# Altium schematic sheet AmplifierDclass_Driver.SchDoc
size 420 x 297 mm; DocumentNumber: Введите номер платы + Э3; SheetNumber: номер страницы; Format: A3
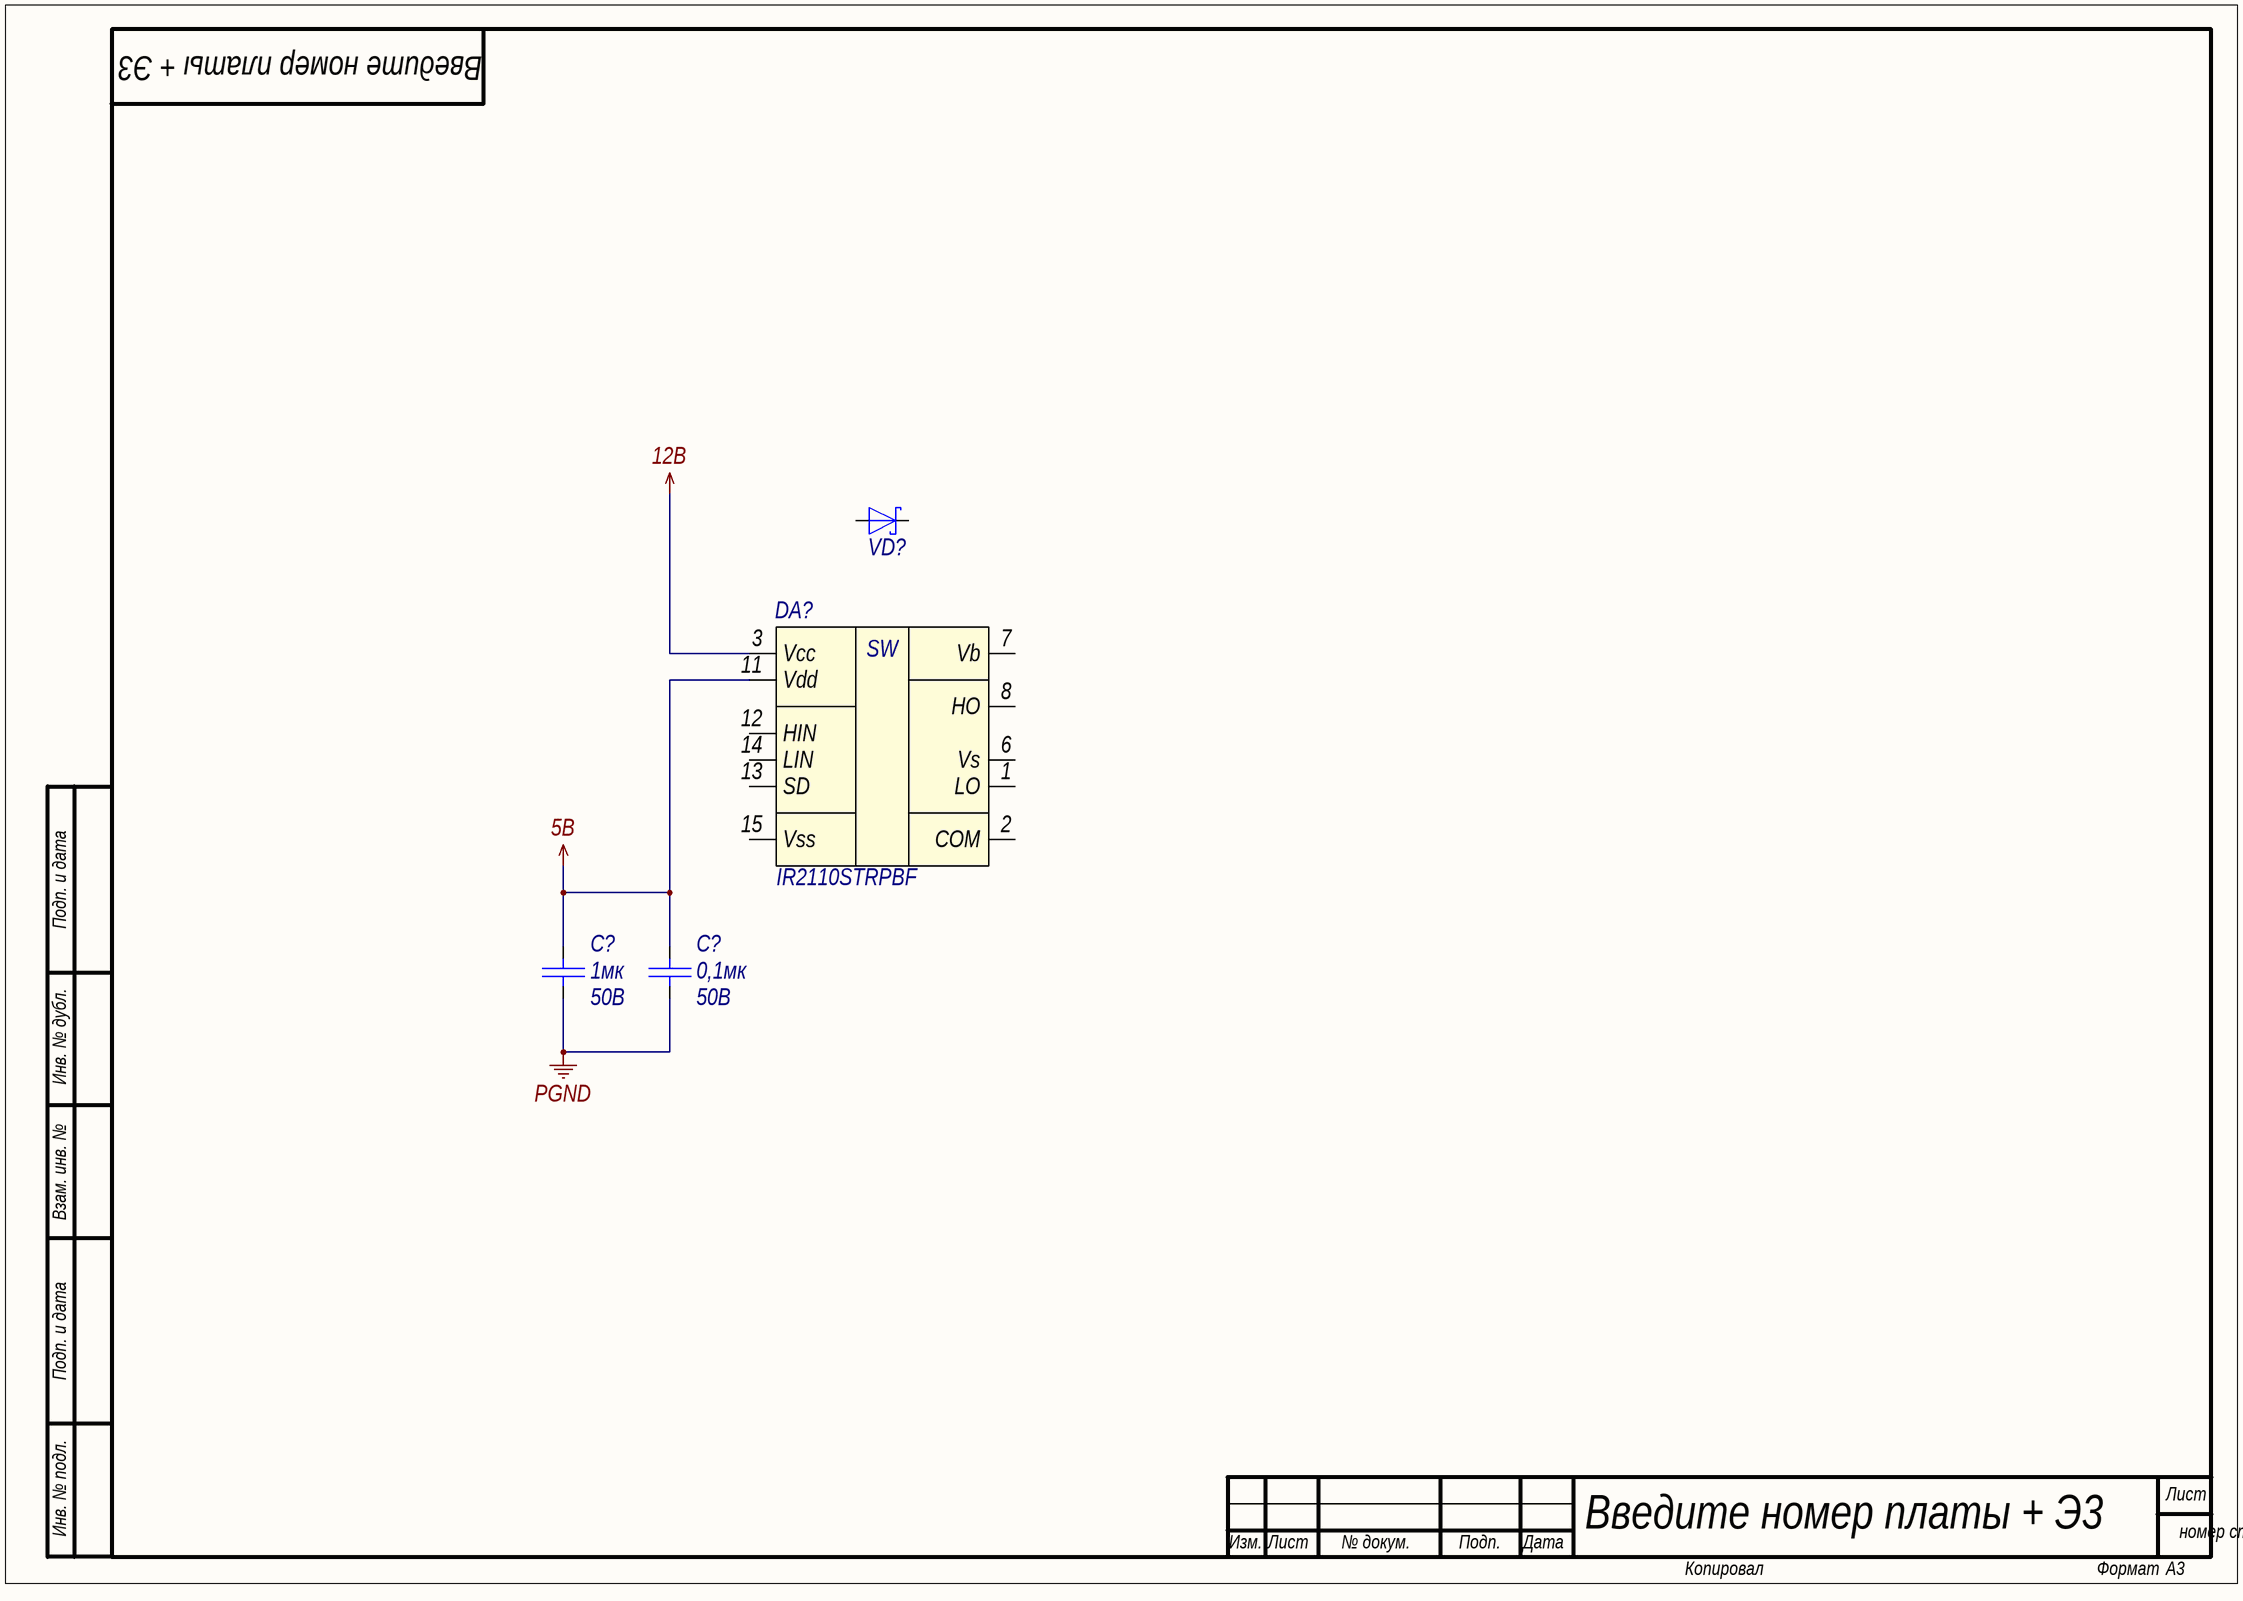
[diagram p0: AmplifierDclass_Driver.SchDoc]

## Parts
(Parts that share a designator on the sheet are numbered #1, #2 ... from top to bottom, then left to right.)
C?#1  value 1мк  Voltage: 50B  [C0805]  (hidden comment: Capacitor)
C?#2  value 0,1мк  Voltage: 50В  [C0805]  (hidden comment: Capacitor)
DA?  Part Number: IR2110STRPBF  [SO16]  (hidden comment: IR2110S)
VD?  DiodeSchottky  [SMA]  (value not drawn)

## Nets
5B: C?#1.2 C?#2.2 DA?.11(Vdd)
12B: DA?.3(Vcc)
PGND: C?#1.1 C?#2.1

Not connected (* = marked no-connect by the designer): DA? 1(LO) 2(COM) 6(Vs) 7(Vb) 8(HO) 12(HIN) 13(SD) 14(LIN) 15(Vss); VD? 1(K) 2(A)

## Notes on the sheet
- Подп. и дата
- Инв. № дубл.
- Взам. инв. №
- Инв. № подл.
- Лист
- Изм.
- № докум.
- Подп.
- Дата
- Копировал
- Формат
- (in symbol driver23) SW

## Library data of the parts
C?#1 = cap151: Конденсатор; Part Name: Ceramic; Manufacture: Murata; Part Number: GRM21BR71H105K; id: cap151; TKE: X7R
C?#2 = cap160: Конденсатор; Part Name: Ceramic; Manufacture: Murata; Part Number: GRM21BR71H104KA01L; id: cap160; TKE: X7R
DA? = driver23: High and Low Side Driver; Manufacture: International Rectifier; Logic High: 3-20B; Logic Low: 1,5-8B; Min Operating Supply Voltage: 10B; Max Operating Supply Voltage: 20B; Maximum output current: 2,5A; id: driver23; Part Name: High and Low side Driver
VD? = diode1: Диод Шоттки; Part Number: SK34A; Manufacture: Taiwan Semiconductor; id: diode1; Max Reverse Voltage: 40B; Forward Voltage: 0,55B; Forward Current: 3A; Part Name: Diode Schottky